# EasyEDA Pro project 26年中国机器人大赛自动分拣机器人主控板_2026-08-09.epro

# Schematic Schematic1
Board Name: Board1; Create Date: 2026-07-24; Page Name: P1; Project Name: 26年中国机器人大赛自动分拣机器人主控板; Schematic Name: Schematic1; Update Date: 2026-07-24; Company: 嘉立创EDA; Page Size: A4; Version: V1.0
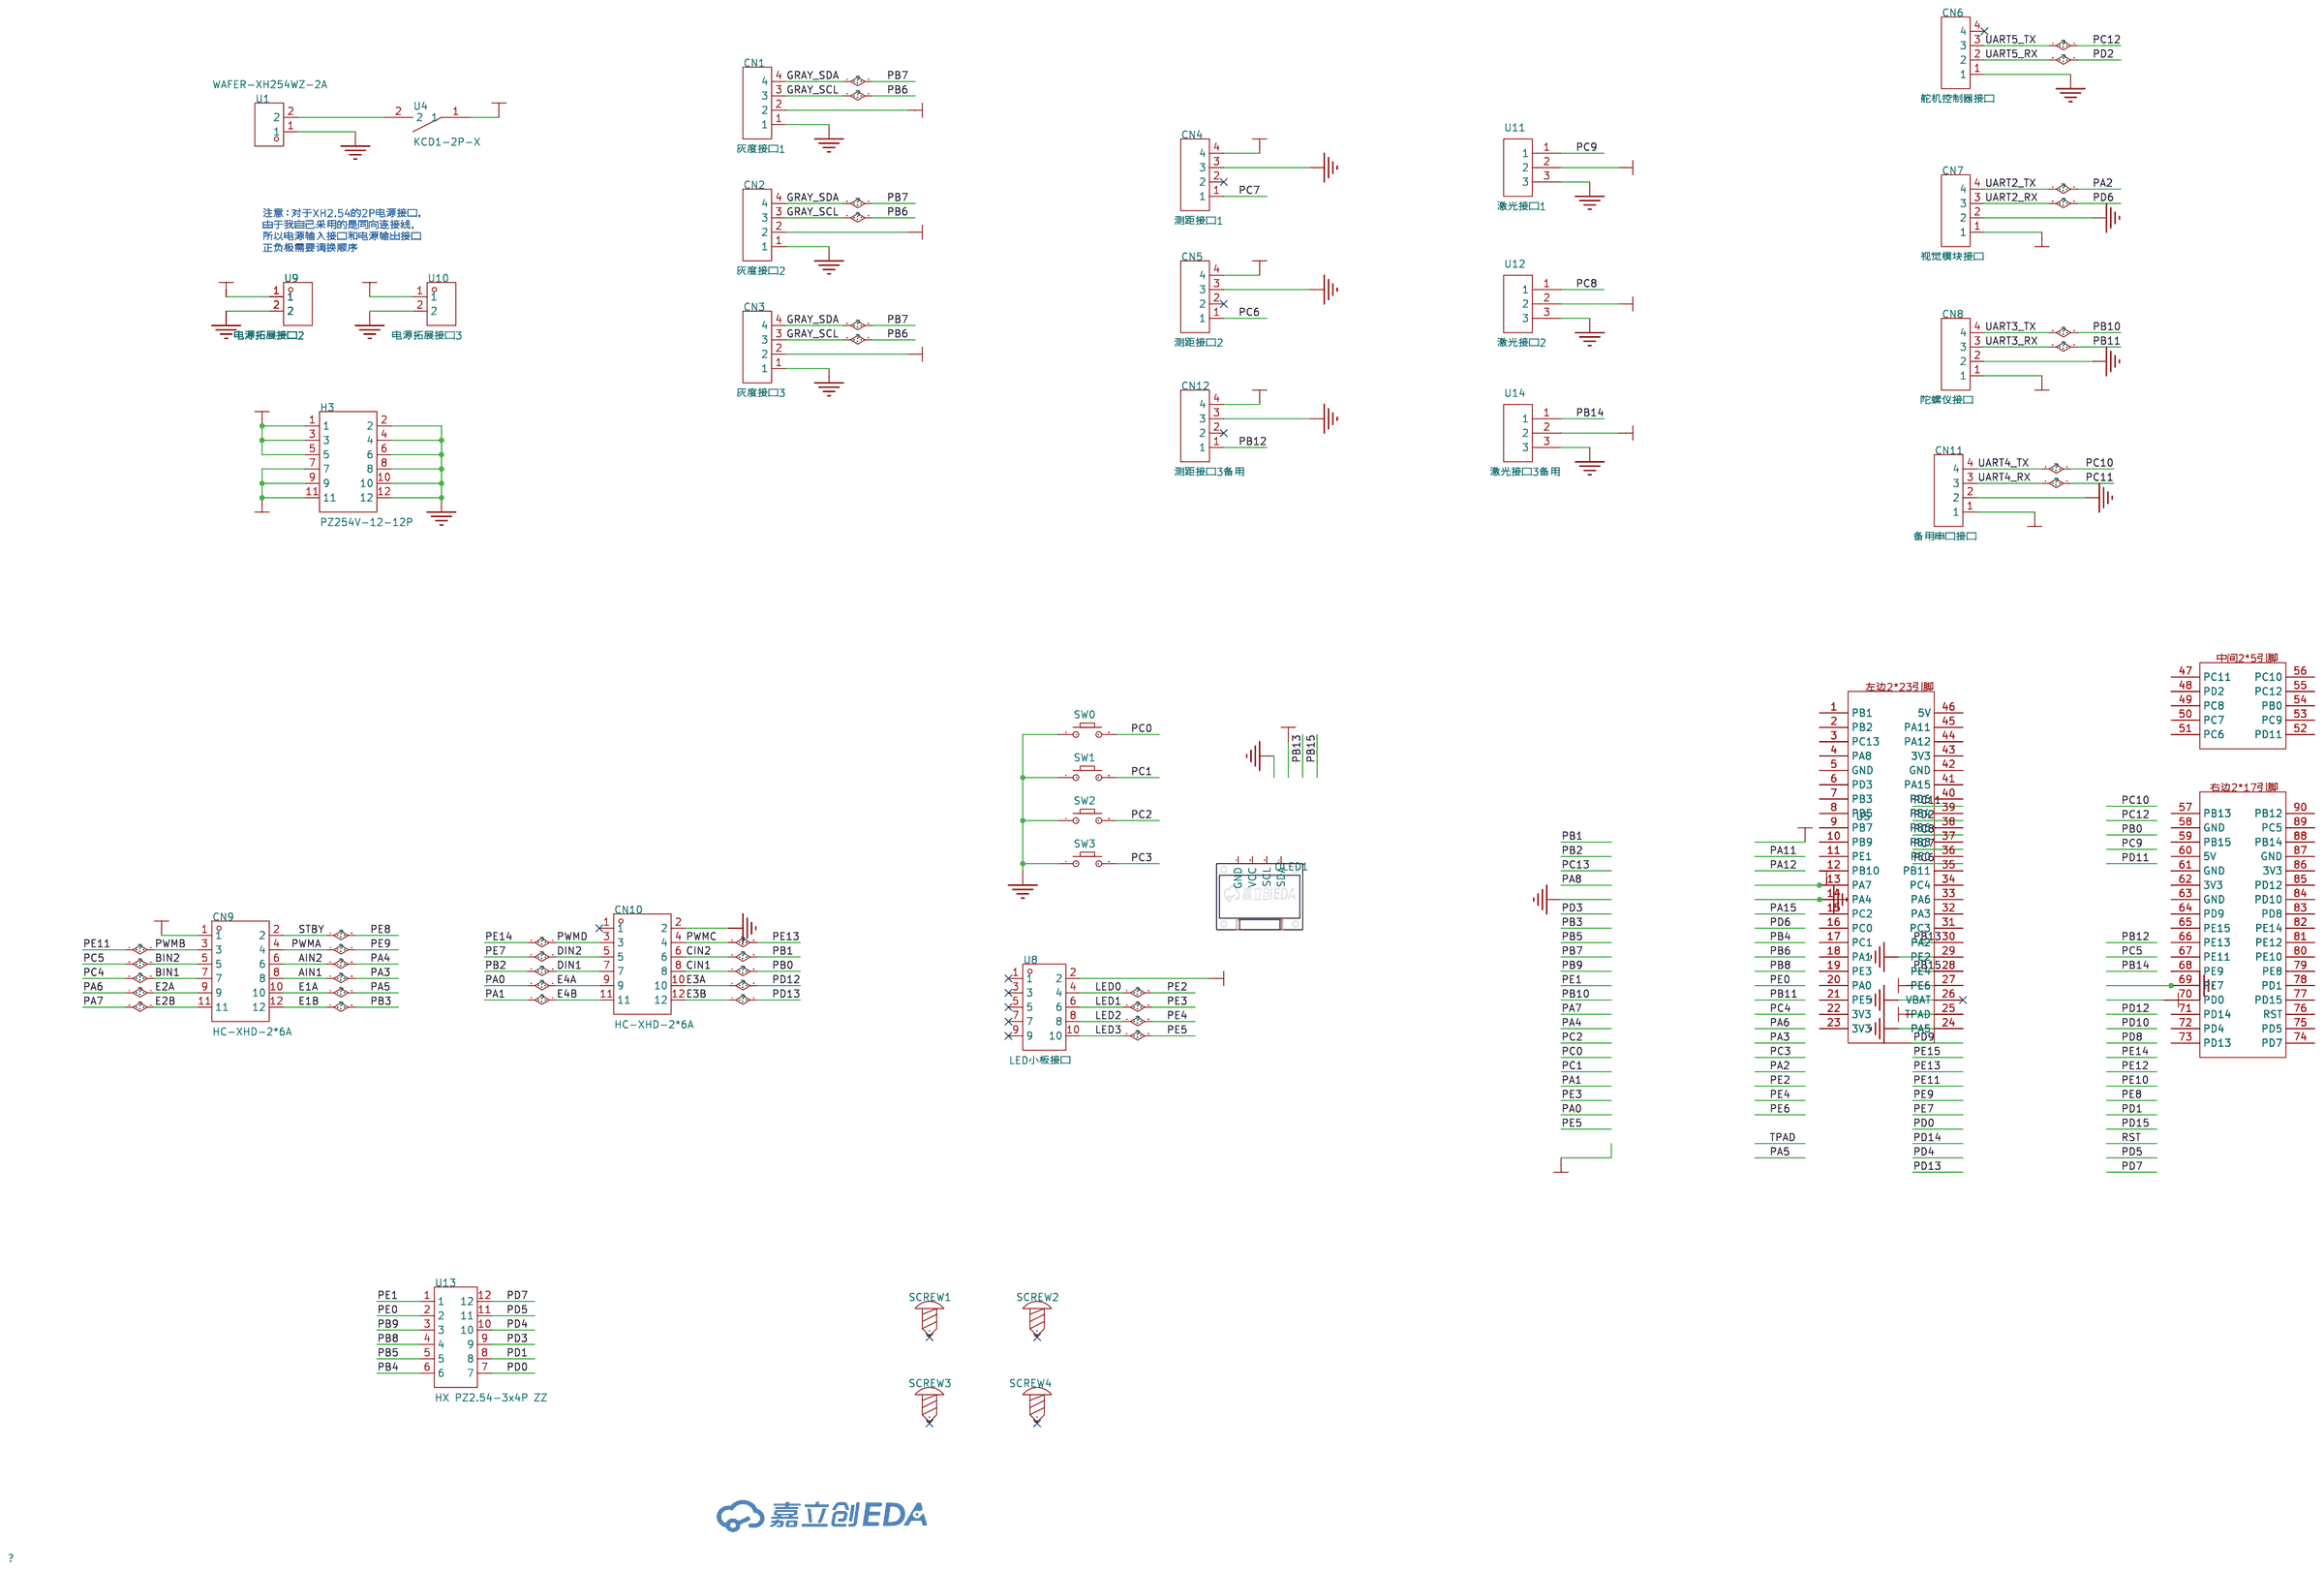
[diagram p0: schematic sheet]

## Parts
CN1  灰度接口1  [CONN-TH_4P-P2.50-XH2.54-4P]
CN2  灰度接口2  [CONN-TH_4P-P2.50-XH2.54-4P]
CN3  灰度接口3  [CONN-TH_4P-P2.50-XH2.54-4P]
CN4  测距接口1  [CONN-TH_4P-P2.50-XH2.54-4P]
CN5  测距接口2  [CONN-TH_4P-P2.50-XH2.54-4P]
CN6  舵机控制器接口  [CONN-TH_4P-P2.50-XH2.54-4P]
CN7  视觉模块接口  [CONN-TH_4P-P2.50-XH2.54-4P]
CN8  陀螺仪接口  [CONN-TH_4P-P2.50-XH2.54-4P]
CN9  HC-XHD-2*6A  [CONN-TH_12P-P2.50_HCTL_HC-XHD-2X6A]
CN10  HC-XHD-2*6A  [CONN-TH_12P-P2.50_HCTL_HC-XHD-2X6A]
CN11  备用串口接口  [CONN-TH_4P-P2.50-XH2.54-4P]
CN12  测距接口3备用  [CONN-TH_4P-P2.50-XH2.54-4P]
H3  PZ254V-12-12P  [HDR-TH_12P-P2.54-V-M-R2-C6-S2.54]
OLED1  -  [0.96OLED_4P]
SCREW1  -  [M3螺丝]
SCREW2  -  [M3螺丝]
SCREW3  -  [M3螺丝]
SCREW4  -  [M3螺丝]
SW0  -  [Key_TH_3.5x6x4.3]
SW1  -  [Key_TH_3.5x6x4.3]
SW2  -  [Key_TH_3.5x6x4.3]
SW3  -  [Key_TH_3.5x6x4.3]
U1  WAFER-XH254WZ-2A  [CONN-TH_2P-P2.50_WAFER-XH254WZ-2A]
U4  KCD1-2P-X  [SW-TH_KCD1-101]
U5  -  [STM32F407勇气号]
U8  LED小板接口  [HDR-TH_10P-P2.54-V-F-R2-C5-S2.54]
U9  电源拓展接口2  [CONN-TH_2P-P2.50_WAFER-XH254WZ-2A]
U10  电源拓展接口3  [CONN-TH_2P-P2.50_WAFER-XH254WZ-2A]
U11  激光接口1  [CONN-TH_3P-P2.50_A2501WV2-3P]
U12  激光接口2  [CONN-TH_3P-P2.50_A2501WV2-3P]
U13  HX PZ2.54-3x4P ZZ  [HDR-TH_12P-P2.54-V-M-R3-C4-S2.54]
U14  激光接口3备用  [CONN-TH_3P-P2.50_A2501WV2-3P]

## Library data of the parts
CN1-CN8 CN11 CN12 = HX-XH2.54-4PZZ: 插针结构:1x4P;间距:2.54mm;安装方式:直插;参考系列:XH;总PIN数:4P;排数:1;每排PIN数:4;行距:-;额定电流:3A;触头材质:黄铜;触头镀层:锡;工作温度:-25℃~+85℃;; LCSC Part Name: 1x4P 间距:2.54mm 直插 系列:XH; Supplier Part: C42391662; Manufacturer: hanxia(韩下); Supplier Footprint: 插件,P=2.5mm; JLCPCB Part Class: 扩展库; Datasheet: https://item.szlcsc.com/datasheet/HX-XH2.54-4PZZ/44326934.html; Supplier: LCSC; Pins Structure: 1x4P; Pitch: 2.54mm; Mounting Type: 直插; Reference Series: XH; Number of Pins: 4P; Number of Rows: 1; Number of PINs Per Row: 4; Current Rating: 3A; Contact Material: 黄铜; Contact Plating: 锡; Operating Temperature: -25℃~+85℃; Voltage Rating: 250V; Plastic Material: PA66; Flame Retardant Rating: UL94V-0; Color: 白色
CN9 CN10 = HC-XHD-2*6A: 插针结构:2x6P;间距:2.5mm;安装方式:直插;参考系列:DF1B;总PIN数:12P;排数:2;每排PIN数:6;行距:2.5mm;额定电流:3A;触头材质:黄铜;触头镀层:锡;工作温度:-25℃~+85℃;; LCSC Part Name: 2x6P 间距:2.5mm 直插 系列:DF1B; Supplier Part: C2845653; Manufacturer: HCTL(华灿天禄); Supplier Footprint: 插件,P=2.5mm; JLCPCB Part Class: 扩展库; Datasheet: https://item.szlcsc.com/datasheet/HC-XHD-2*6A/3039334.html; Supplier: LCSC; Pins Structure: 2x6P; Pitch: 2.5mm; Mounting Type: 直插; Reference Series: DF1B; Number of Pins: 12P; Number of Rows: 2; Number of PINs Per Row: 6; Row Spacing: 2.5mm; Current Rating: 3A; Contact Material: 黄铜; Contact Plating: 锡; Operating Temperature: -25℃~+85℃; Voltage Rating: 250V; Plastic Material: PA66; Z-Height of the Board: 9.5mm; X-Length of Bottom Edge on Board (Spacing Line): 17.5mm; Y-Width of Bottom Edge on Board: 8.6mm
H3 = PZ254V-12-12P: 插针结构:2x6P;间距:2.54mm;行距:2.54mm;圆针/方针:方针;安装方式:直插;排数:双排;总PIN位数:12P;额定电流:-;额定电压:-;配合针长度:6mm;塑高:2.5mm;端接针长度:3mm;触头材质:黄铜;触头镀层:-;工作温度:-40℃~+105℃;颜色:黑色;; LCSC Part Name: 2x6P 间距:2.54mm 方针 直插; Supplier Part: C492423; Manufacturer: XFCN(兴飞); Supplier Footprint: 插件,P=2.54mm; JLCPCB Part Class: 扩展库; Datasheet: https://item.szlcsc.com/datasheet/PZ254V-12-12P/502979.html; Supplier: LCSC; Pin Structure: 2x6P; Pitch: 2.54mm; Row Spacing: 2.54mm; Circluar Pins/Square Pins: 方针; Mounting Type: 直插; Number of Rows: 双排; Number of Pins: 12P; Length of Mating Pin: 6mm; Insulation Height: 2.5mm; Length of End Connection Pin: 3mm; Contact Material: 黄铜; Operating Temperature: -40℃~+105℃; Color: 黑色
OLED1 = 0.96OLED模块_4P: Supplier Footprint: 插件
SCREW1-SCREW4 = M3螺丝: Supplier Footprint: 插件
SW0-SW3 = Key_TH_3.5x6x4.3: Supplier Footprint: 插件
U1 U9 U10 = WAFER-XH254WZ-2A: 插针结构:1x2P;间距:2.54mm;安装方式:弯插;参考系列:XH;总PIN数:2P;排数:1;每排PIN数:2;额定电流:3A;触头材质:黄铜;工作温度:-25℃~+85℃;; LCSC Part Name: 1x2P 间距:2.54mm 弯插 系列:XH; Supplier Part: C7432691; Manufacturer: HANBO(汉博); Supplier Footprint: 插件,P=2.5mm; JLCPCB Part Class: 扩展库; Datasheet: https://item.szlcsc.com/datasheet/WAFER-XH254WZ-2A/8437688.html; Supplier: LCSC; Pins Structure: 1x2P; Pitch: 2.54mm; Mounting Type: 弯插; Reference Series: XH; Number of Pins: 2P; Number of Rows: 1; Number of PINs Per Row: 2; Current Rating: 3A; Contact Material: 黄铜; Operating Temperature: -25℃~+85℃; Voltage Rating: 250V; Plastic Material: PA66; Flame Retardant Rating: UL94V-0
U4 = 船型开关KCD1-2P-X: 带灯:无;引脚样式:焊片;额定电流:6A;额定电压(AC):250V;额定电压(DC):-;电路结构:单刀单掷;机械寿命:1万次;; Manufacturer: SHOU HAN(首韩); Supplier: LCSC; Supplier Part: C5884416; LCSC Part Name: 15*21mm 两脚两档跷板开关 斜面 黑; Supplier Footprint: 插件; JLCPCB Part Class: 扩展库; Datasheet: https://atta.szlcsc.com/upload/public/pdf/source/20230506/16C42A317FEEB785E209504D8AD10702.pdf; Switch Length: 21mm; Switch Width: 15mm; Switch Height: 21mm; Actuator Type: 凹面弯曲; With Lamp: 无; Pin Style: 焊片; Actuator Color: 黑色; Contact Current: 6A; Voltage Rating (AC): 250V; Circuit: 单刀单掷; Mechanical Life: 1万次; Operating Temperature: 0℃~+125℃; Actuator Identifier: - O
U5 = STM32F407勇气号
U8 = PM254-2-05-Z-8.5: 插孔结构:2x5P;间距:2.54mm;行距:2.54mm;圆孔/方孔:方孔;安装方式:直插;排数:双排;总孔位数:10P;额定电流:3A;额定电压:-;插孔方向:顶部;塑高:8.5mm;触头材质:铜合金;工作温度:-40℃~+105℃;; LCSC Part Name: 2x5P 间距:2.54mm 直插; Supplier Part: C2897406; Manufacturer: HCTL(华灿天禄); Supplier Footprint: 插件,P=2.54mm; JLCPCB Part Class: 扩展库; Datasheet: https://item.szlcsc.com/datasheet/PM254-2-05-Z-8.5/3142411.html; Supplier: LCSC; Holes Structure: 2x5P; Pitch: 2.54mm; Row Spacing: 2.54mm; Circular Hole / Square Hole: 方孔; Mounting Type: 直插; Number of Rows: 双排; Number of Positions: 10P; Current Rating: 3A; Holes Direction: 顶部; Insulation Height: 8.5mm; Contact Material: 铜合金; Operating Temperature: -40℃~+105℃
U11 U12 U14 = B3B-XH-A(LF)(SN): 插针结构:1x3P;间距:2.5mm;安装方式:直插;参考系列:XH;总PIN数:3P;排数:1;每排PIN数:3;行距:-;额定电流:3A;触头材质:黄铜;触头镀层:锡;工作温度:-25℃~+85℃;; LCSC Part Name: 1x3P 间距:2.5mm 直插 系列:XH; Supplier Part: C144394; Manufacturer: JST; Supplier Footprint: 插件,P=2.5mm; JLCPCB Part Class: 扩展库; Datasheet: https://item.szlcsc.com/datasheet/B3B-XH-A(LF)(SN)/155726.html; Supplier: LCSC; Pins Structure: 1x3P; Pitch: 2.5mm; Mounting Type: 直插; Reference Series: XH; Number of Pins: 3P; Number of Rows: 1; Number of PINs Per Row: 3; Current Rating: 3A; Contact Material: 黄铜; Contact Plating: 锡; Operating Temperature: -25℃~+85℃; Voltage Rating: 250V; Plastic Material: PA66; Flame Retardant Rating: UL94V-0; Supplementary Features: 打K脚; Color: 白色; Z-Height of the Board: 7mm; X-Length of Bottom Edge on Board (Spacing Line): 9.9mm; Y-Width of Bottom Edge on Board: 5.75mm
U13 = HX PZ2.54-3x4P ZZ: 插针结构:3x4P;间距:2.54mm;行距:2.54mm;圆针/方针:方针;安装方式:直插;排数:三排;总PIN位数:12P;额定电流:3A;额定电压:1kV;配合针长度:6mm;塑高:2.5mm;端接针长度:3mm;触头材质:黄铜;触头镀层:金;工作温度:-40℃~+105℃;颜色:黑色;; LCSC Part Name: 3x4P 间距:2.54mm 方针 直插; Supplier Part: C32713291; Manufacturer: hanxia(韩下); Supplier Footprint: 插件,P=2.54mm; JLCPCB Part Class: 扩展库; Datasheet: https://item.szlcsc.com/datasheet/HX%2520PZ2.54-3x4P%2520ZZ/34444571.html; Supplier: LCSC; Pin Structure: 3x4P; Pitch: 2.54mm; Row Spacing: 2.54mm; Circluar Pins/Square Pins: 方针; Mounting Type: 直插; Number of Rows: 三排; Number of Pins: 12P; Current Rating: 3A; Voltage Rating (Max): 1kV; Length of Mating Pin: 6mm; Insulation Height: 2.5mm; Length of End Connection Pin: 3mm; Contact Material: 黄铜; Contact Plating: 金; Operating Temperature: -40℃~+105℃; Color: 黑色

## Nets
3V3: CN9.1 H3.7 H3.9 H3.11 U5.13(PA7) U5.25(TPAD) U8.2
5V: CN1.2 CN2.2 CN3.2 CN4.4 CN5.4 CN7.1 CN8.1 CN11.1 CN12.4 H3.1 H3.3 H3.5 U4.1 U5.27(PE6) U9.1 U10.1 U11.2 U12.2 U14.2
GND: CN1.1 CN2.1 CN3.1 CN4.3 CN5.3 CN6.1 CN7.2 CN8.2 CN10.2 CN11.2 CN12.3 H3.2 H3.4 H3.6 H3.8 H3.10 H3.12 SW0.A SW1.A SW2.A SW3.A U1.1 U5.14(PA4) U5.24(PA5) U5.26(VBAT) U5.29(PE2) U5.69(PE7) U9.2 U10.2 U11.3 U12.3 U14.3
AIN1: CN9.8
AIN2: CN9.6
BIN1: CN9.7
BIN2: CN9.5
CIN1: CN10.8
CIN2: CN10.6
DIN1: CN10.7
DIN2: CN10.5
E1A: CN9.10
E1B: CN9.12
E2A: CN9.9
E2B: CN9.11
E3A: CN10.10
E3B: CN10.12
E4A: CN10.9
E4B: CN10.11
GRAY_SCL: CN1.3 CN2.3 CN3.3
GRAY_SDA: CN1.4 CN2.4 CN3.4
LED0: U8.4
LED1: U8.6
LED2: U8.8
LED3: U8.10
PA2: CN7.4
PB4: U13.6
PB5: U13.5
PB8: U13.4
PB9: U13.3
PB10: CN8.4
PB11: CN8.3
PB12: CN12.1
PB13: U5.30(PA2)
PB14: U14.1
PB15: U5.28(PE4)
PC0: SW0.B
PC1: SW1.B
PC2: SW2.B
PC3: SW3.B
PC6: CN5.1
PC7: CN4.1
PC8: U12.1
PC9: U11.1
PC10: CN11.4
PC11: CN11.3
PC12: CN6.3
PD0: U13.7
PD1: U13.8
PD2: CN6.2
PD3: U13.9
PD4: U13.10
PD5: U13.11
PD6: CN7.3
PD7: U13.12
PE0: U13.2
PE1: U13.1
PE8: CN9.2
PE9: CN9.4
PE11: CN9.3
PE13: CN10.4
PE14: CN10.3
$1N183: U1.2 U4.2

Not connected (* = marked no-connect by the designer): CN4 2*; CN5 2*; CN6 4*; CN10 1*; CN12 2*; OLED1 1(GND) 2(VCC) 3(SCL) 4(SDA); SCREW1 1*; SCREW2 1*; SCREW3 1*; SCREW4 1*; U5 1(PB1) 2(PB2) 3(PC13) 4(PA8) 5(GND) 6(PD3) 7(PB3) 8(PB5) 9(PB7) 10(PB9) 11(PE1) 12(PB10) 15(PC2) 16(PC0) 17(PC1) 18(PA1) 19(PE3) 20(PA0) 21(PE5) 22(3V3) 23(3V3) 31(PC3) 32(PA3) 33(PA6) 34(PC4) 35(PB11) 36(PE0) 37(PB8) 38(PB6) 39(PB4) 40(PD6) 41(PA15) 42(GND) 43(3V3) 44(PA12) 45(PA11) 46(5V) 47(PC11) 48(PD2) 49(PC8) 50(PC7) 51(PC6) 52(PD11) 53(PC9) 54(PB0) 55(PC12) 56(PC10) 57(PB13) 58(GND) 59(PB15) 60(5V) 61(GND) 62(3V3) 63(GND) 64(PD9) 65(PE15) 66(PE13) 67(PE11) 68(PE9) 70(PD0) 71(PD14) 72(PD4) 73(PD13) 74(PD7) 75(PD5) 76(RST) 77(PD15) 78(PD1) 79(PE8) 80(PE10) 81(PE12) 82(PE14) 83(PD8) 84(PD10) 85(PD12) 86(3V3) 87(GND) 88(PB14) 89(PC5) 90(PB12); U8 1* 3* 5* 7* 9*

## Notes on the sheet
- 注意：对于XH2.54的2P电源接口，
  由于我自己采用的是同向连接线，
  所以电源输入接口和电源输出接口
  正负极需要调换顺序

# Board PCB1
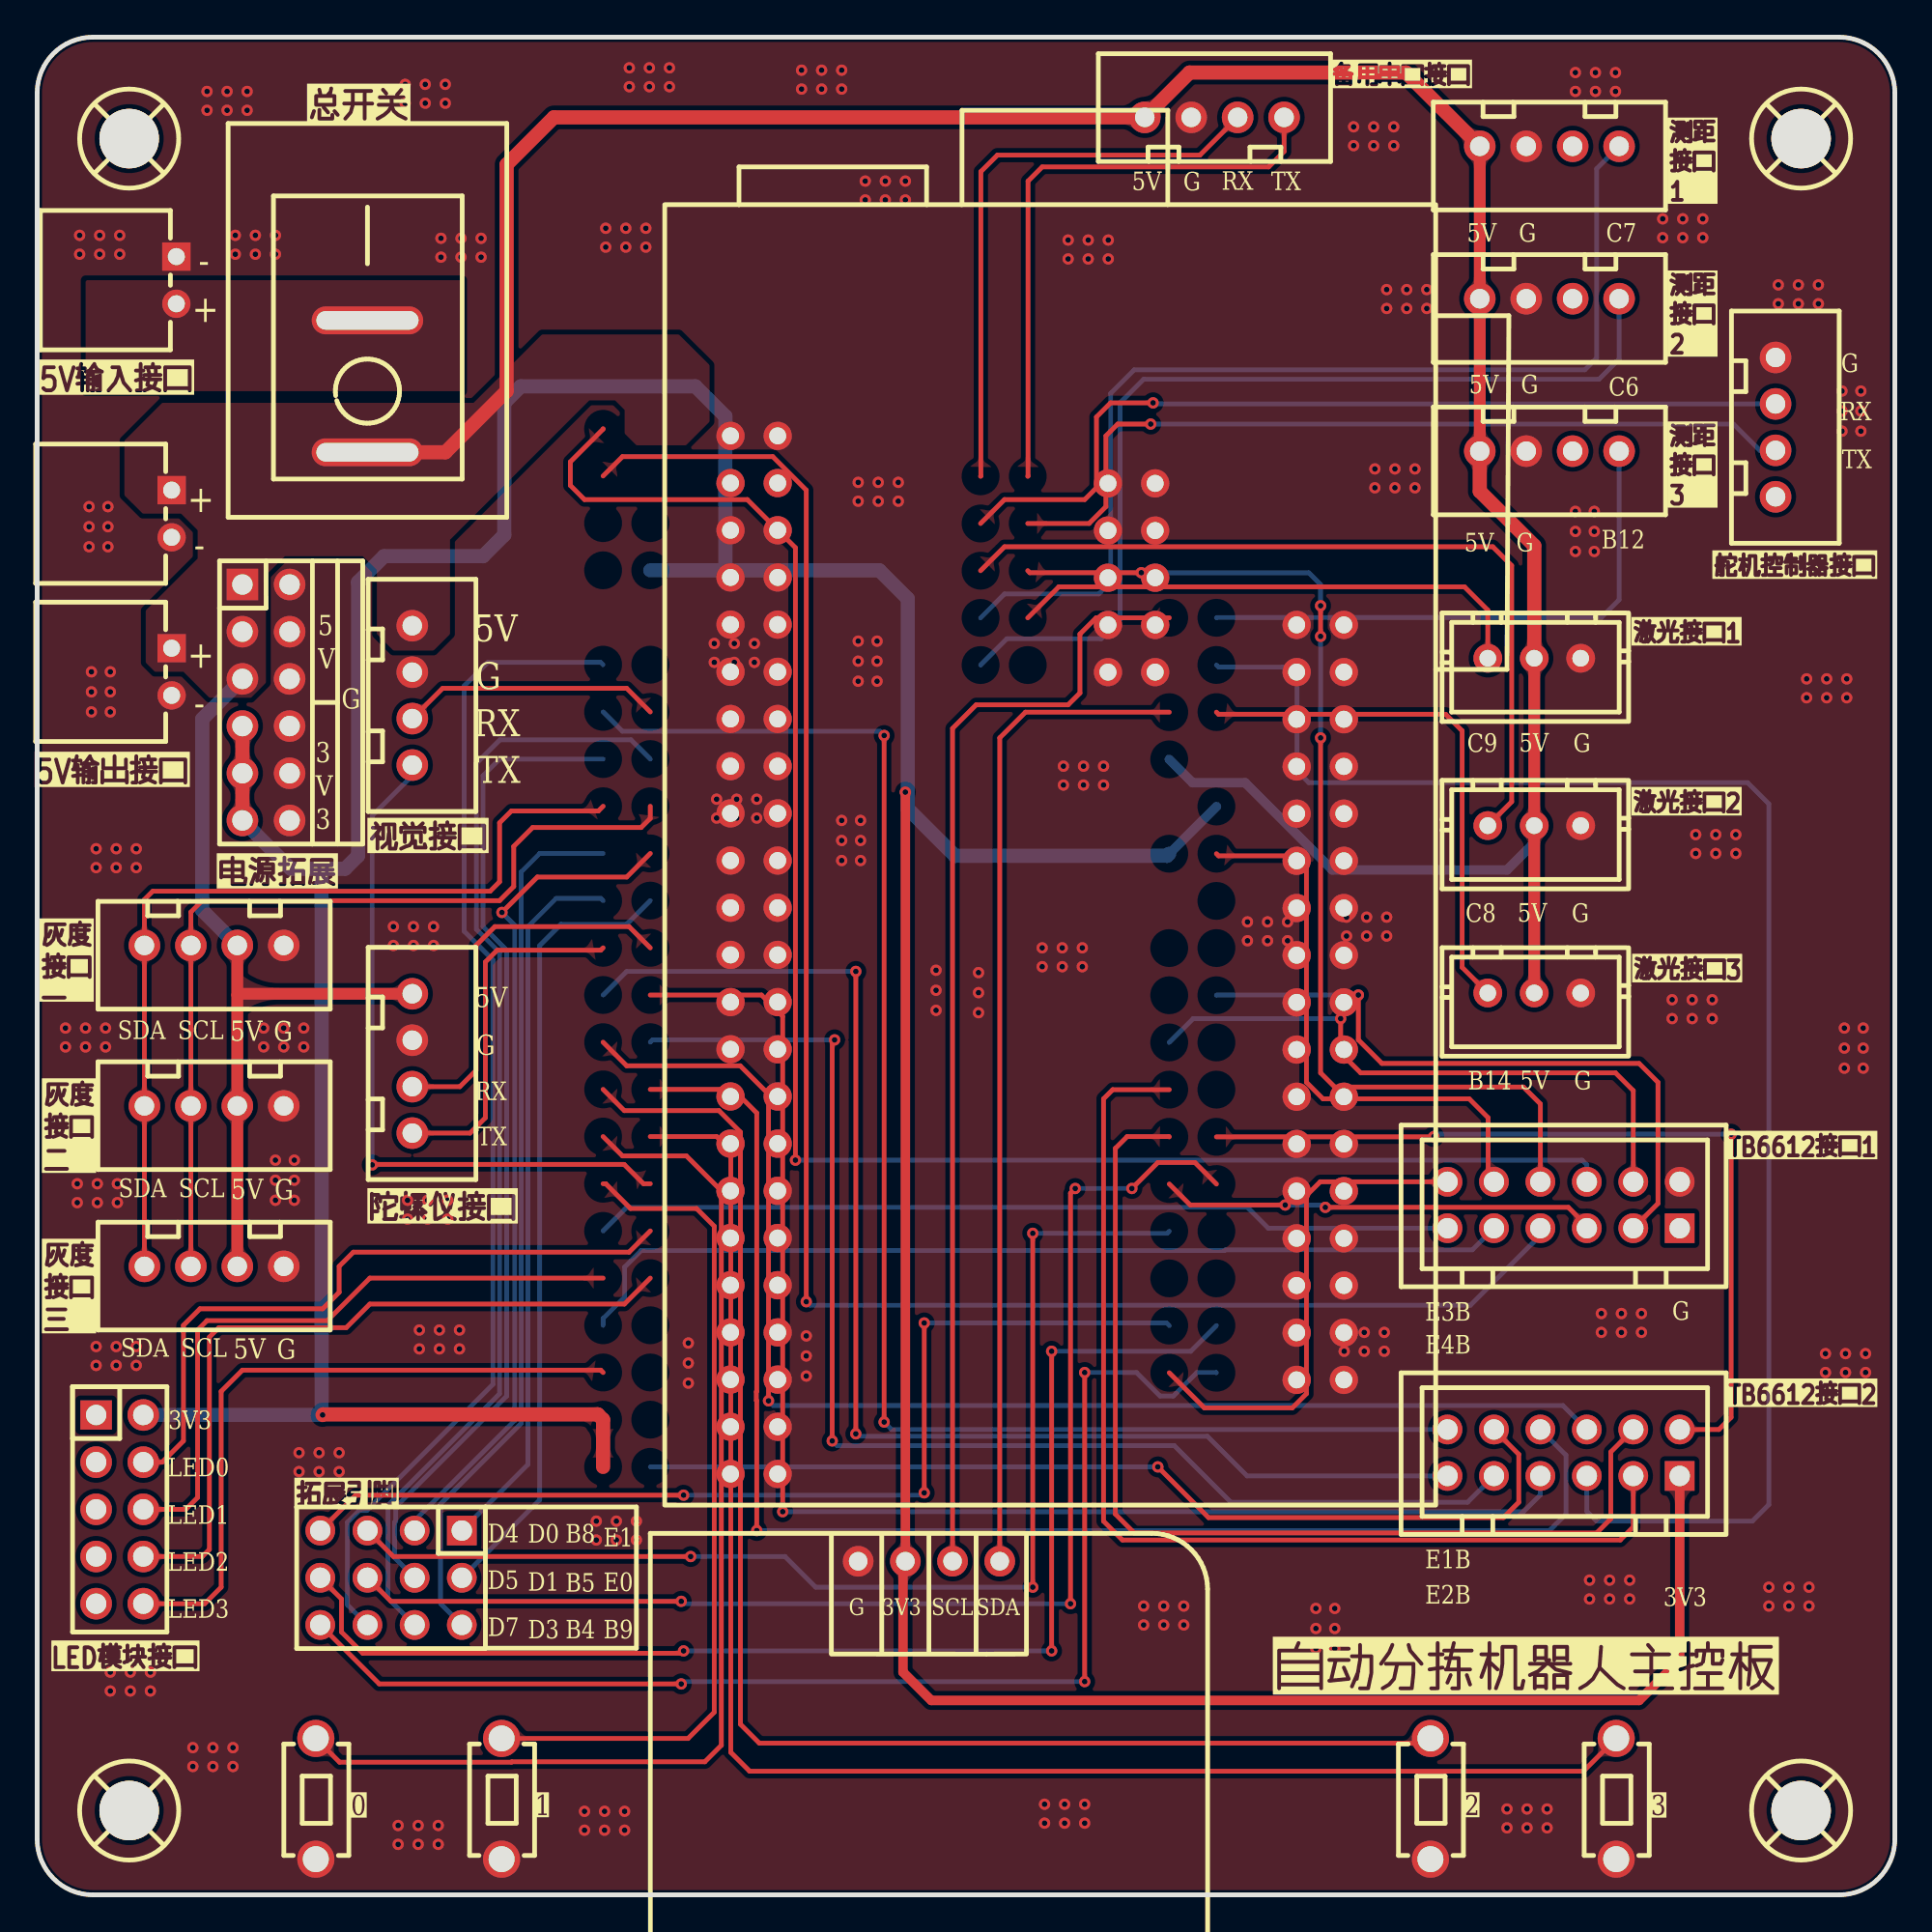
[diagram p1: board, top side]
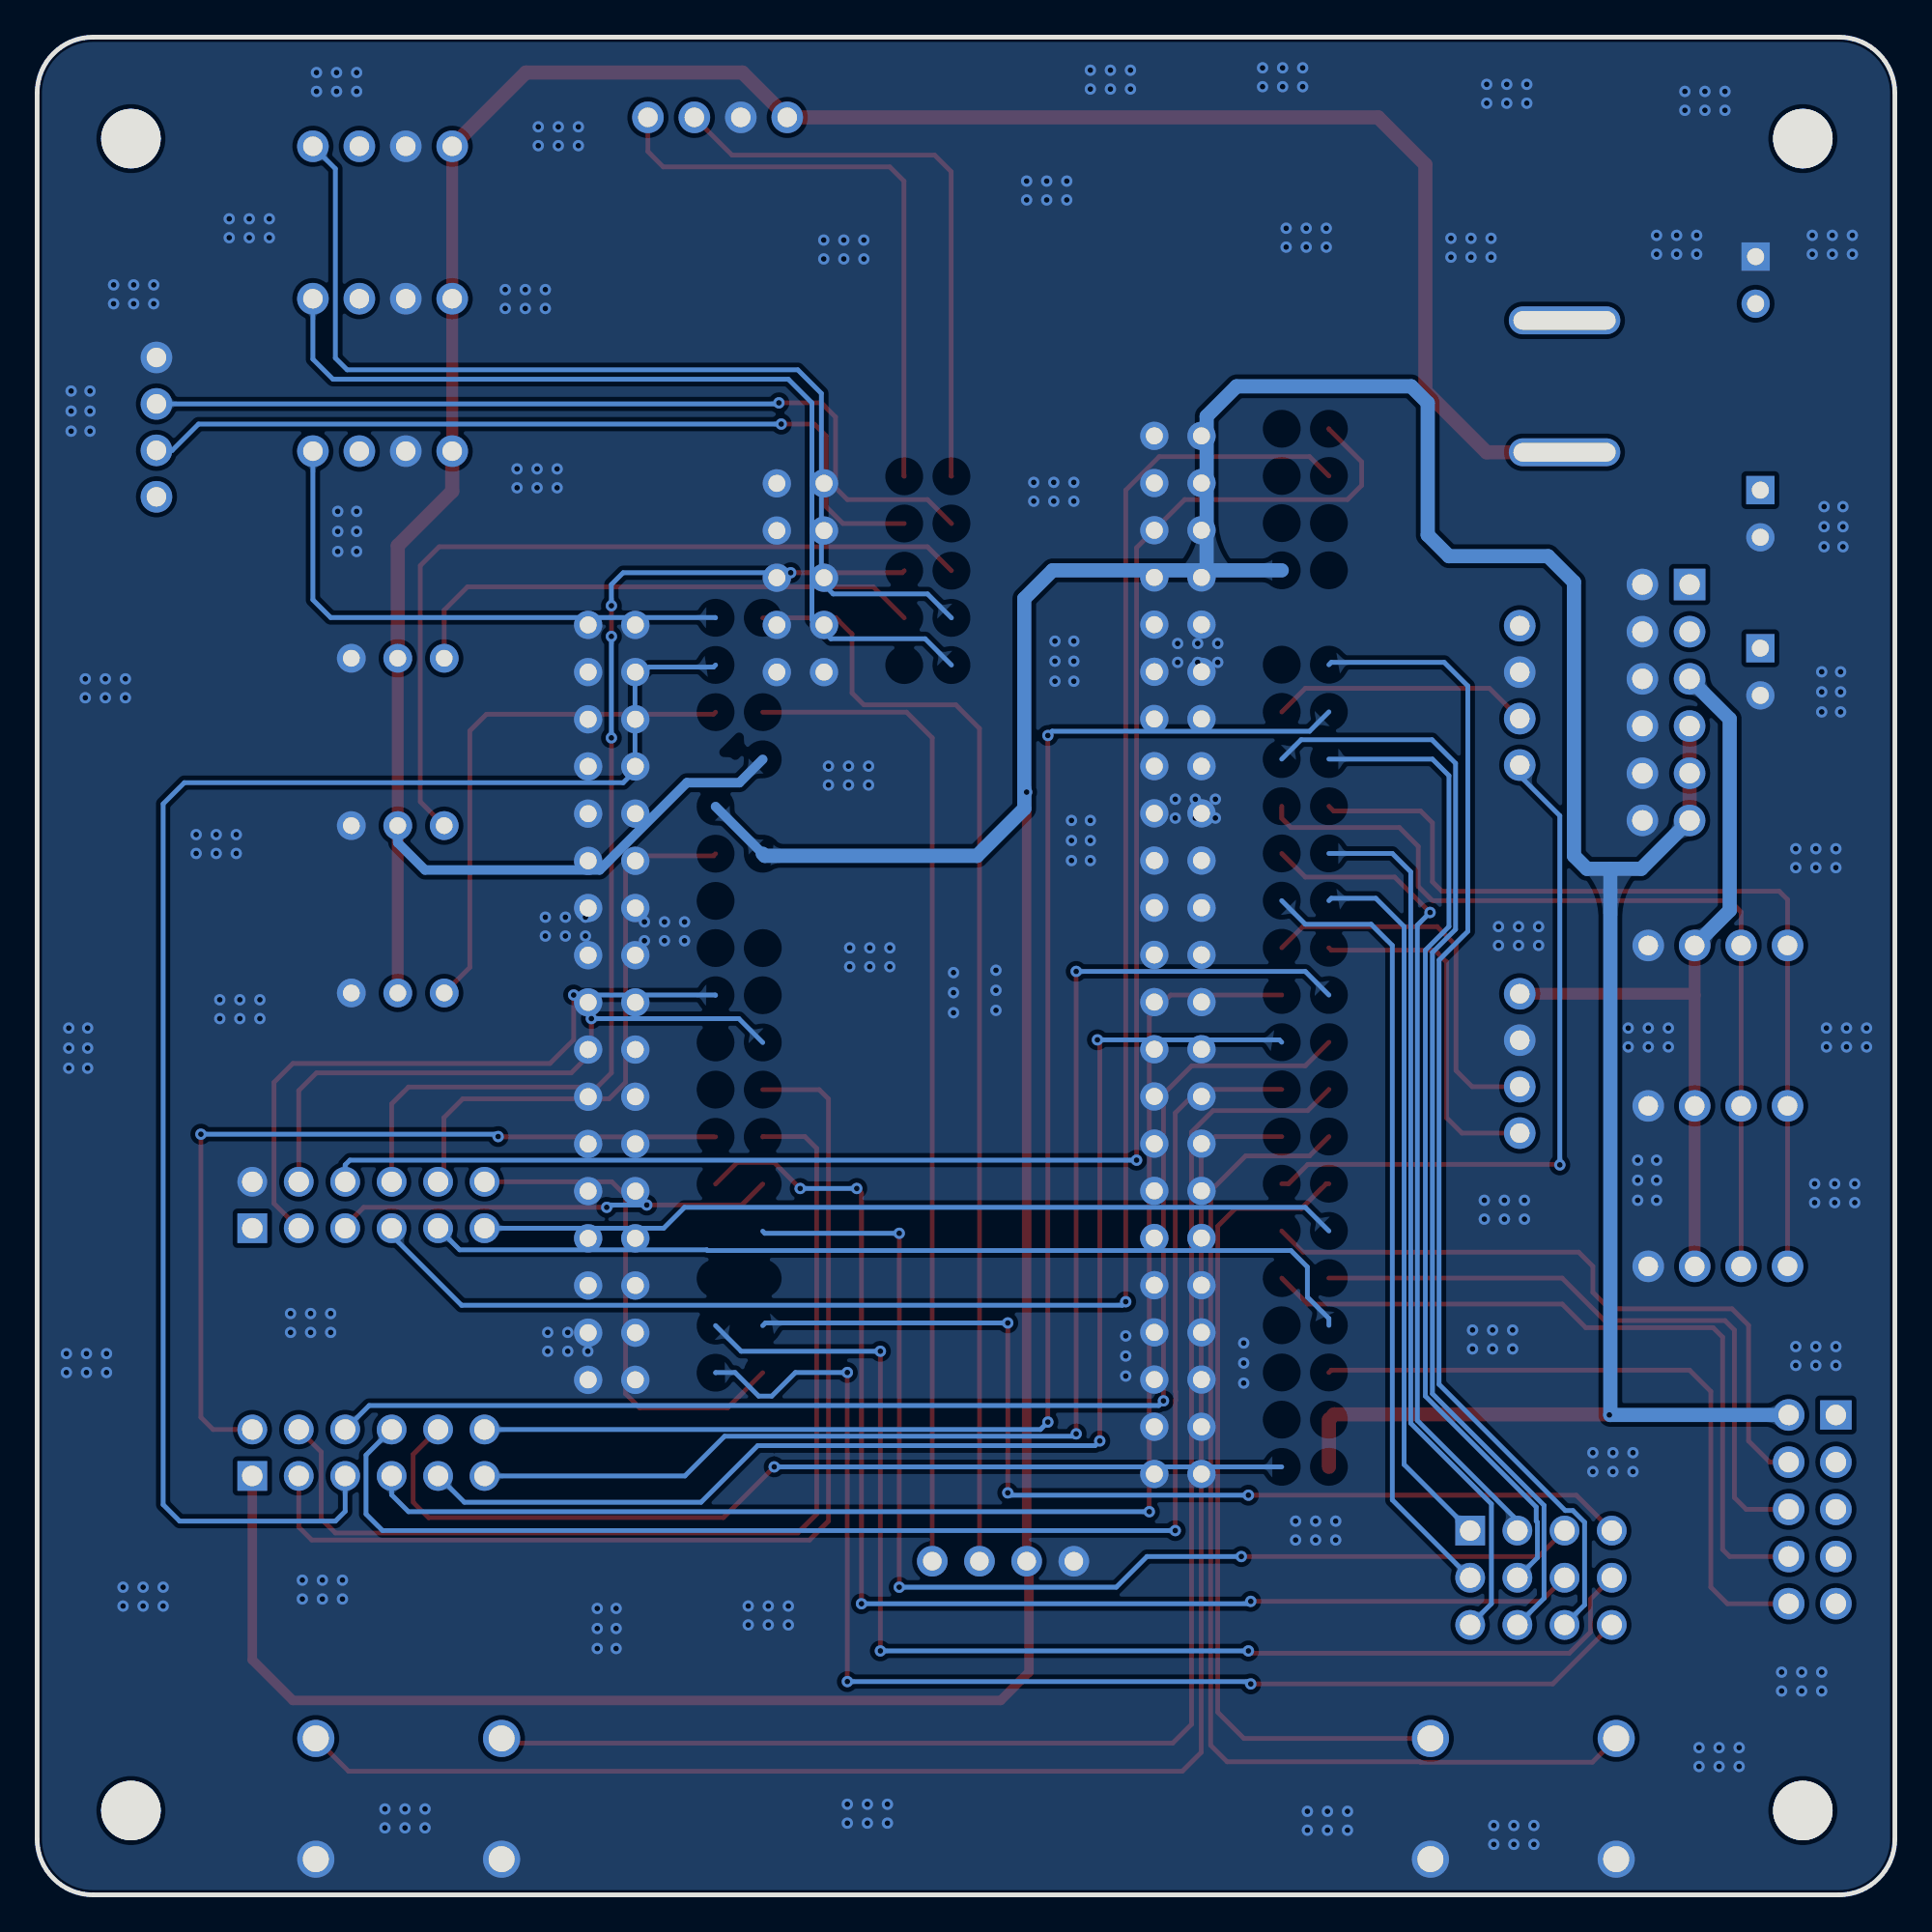
[diagram p2: board, bottom side, seen from below]

Outline 100 x 100 mm; copper layers: Top Layer, Bottom Layer. Coordinates in mm from the lower left corner of the outline.
Outline path: 0,97 0,3 arc(0.88,0.88) 3,0 97,0 arc(99.12,0.88) 100,3 100,97 arc(99.12,99.12) 97,100 3,100 arc(0.88,99.12) 0,97
Stack: Top Layer 0.035mm / Dielectric1 1.51mm FR4 er 4.5 / Bottom Layer 0.035mm

## Design rules (mm)
template: 自定义配置
spacing copperThickness1oz (default): track to track 0.102, other pairs 0.152 to 0.3
spacing copperThickness2oz: track to track 0.203, other pairs 0.152 to 0.3
track width copperThickness1oz (default): min 0.127, default 0.254, max 2.54
track width copperThickness2oz: min 0.203, default 0.254, max 2.54
differential pair differentialPair (default): width min 0.127, default 0.254, max 2.54; gap min 0.152, default 0.152
via viaSize (default): diameter min 0.5, default 0.61, max 10; hole min 0.3, default 0.305, max 6.3

## Placement (name value [footprint] x y rotation side)
CN1  灰度接口1  [CONN-TH_4P-P2.50-XH2.54-4P]  9.53 51.11 0 top
CN2  灰度接口2  [CONN-TH_4P-P2.50-XH2.54-4P]  9.53 42.47 0 top
CN3  灰度接口3  [CONN-TH_4P-P2.50-XH2.54-4P]  9.53 33.83 0 top
CN4  测距接口1  [CONN-TH_4P-P2.50-XH2.54-4P]  81.41 94.12 0 top
CN5  测距接口2  [CONN-TH_4P-P2.50-XH2.54-4P]  81.41 85.92 0 top
CN6  舵机控制器接口  [CONN-TH_4P-P2.50-XH2.54-4P]  93.58 79.01 90 top
CN7  视觉模块接口  [CONN-TH_4P-P2.50-XH2.54-4P]  20.19 64.57 90 top
CN8  陀螺仪接口  [CONN-TH_4P-P2.50-XH2.54-4P]  20.19 44.75 90 top
CN9  HC-XHD-2*6A  [CONN-TH_12P-P2.50_HCTL_HC-XHD-2X6A]  82.17 23.8 0 top
CN10  HC-XHD-2*6A  [CONN-TH_12P-P2.50_HCTL_HC-XHD-2X6A]  82.17 37.14 0 top
CN11  备用串口接口  [CONN-TH_4P-P2.50-XH2.54-4P]  63.37 95.68 180 top
CN12  测距接口3备用  [CONN-TH_4P-P2.50-XH2.54-4P]  81.41 77.72 0 top
H3  PZ254V-12-12P  [HDR-TH_12P-P2.54-V-M-R2-C6-S2.54]  12.32 64.19 270 top
OLED1  -  [0.96OLED_4P]  48.01 17.96 0 top
SCREW1  -  [M3螺丝]  4.95 94.54 0 top
SCREW2  -  [M3螺丝]  94.95 94.54 0 top
SCREW3  -  [M3螺丝]  4.95 4.54 0 top
SCREW4  -  [M3螺丝]  94.95 4.54 0 top
SW0  -  [Key_TH_3.5x6x4.3]  15 5 90 top
SW1  -  [Key_TH_3.5x6x4.3]  25 5 90 top
SW2  -  [Key_TH_3.5x6x4.3]  75 5 90 top
SW3  -  [Key_TH_3.5x6x4.3]  85 5 90 top
U1  WAFER-XH254WZ-2A  [CONN-TH_2P-P2.50_WAFER-XH254WZ-2A]  7.49 86.92 270 top
U4  KCD1-2P-X  [SW-TH_KCD1-101]  17.78 81.2 270 top
U5  -  [STM32F407勇气号]  26.92 91.36 0 top
U8  LED小板接口  [HDR-TH_10P-P2.54-V-F-R2-C5-S2.54]  4.44 20.75 270 top
U9  电源拓展接口2  [CONN-TH_2P-P2.50_WAFER-XH254WZ-2A]  7.24 65.84 270 top
U10  电源拓展接口3  [CONN-TH_2P-P2.50_WAFER-XH254WZ-2A]  7.24 74.35 270 top
U11  激光接口1  [CONN-TH_3P-P2.50_A2501WV2-3P]  80.59 66.57 0 top
U12  激光接口2  [CONN-TH_3P-P2.50_A2501WV2-3P]  80.59 57.56 0 top
U13  HX PZ2.54-3x4P ZZ  [HDR-TH_12P-P2.54-V-M-R3-C4-S2.54]  19.05 17.07 180 top
U14  激光接口3备用  [CONN-TH_3P-P2.50_A2501WV2-3P]  80.59 48.55 0 top

## Footprints (pads in the part's own frame, mm; a bottom-side part is the same pattern mirrored in y, then rotated)
0.96OLED_4P
  round 1.65 hole 1: 1(-3.81,-0.002) 2(-1.27,0.002) 3(1.27,0.002) 4(3.81,0.002)
CONN-TH_2P-P2.50_WAFER-XH254WZ-2A
  rect 1.524x1.524 hole 0.914: 1(-1.27,0)
  round 1.524 hole 0.914: 2(1.27,0)
CONN-TH_3P-P2.50_A2501WV2-3P
  round 1.55 hole 0.9: 1(-2.5,0) 2(0,0) 3(2.5,0)
CONN-TH_4P-P2.50-XH2.54-4P
  round 1.7 hole 1.05: 1(3.75,0) 2(1.25,0) 3(-1.25,0) 4(-3.75,0)
CONN-TH_12P-P2.50_HCTL_HC-XHD-2X6A
  rect 1.6x1.6 hole 1.1: 1(6.25,-1.25)
  round 1.6 hole 1.1: 2(6.25,1.25) 3(3.75,-1.25) 4(3.75,1.25) 5(1.25,-1.25) 6(1.25,1.25) 7(-1.25,-1.25) 8(-1.25,1.25) 9(-3.75,-1.25) 10(-3.75,1.25) 11(-6.25,-1.25) 12(-6.25,1.25)
HDR-TH_10P-P2.54-V-F-R2-C5-S2.54
  rect 1.575x1.7 hole 1.1: 1(-5.08,-1.27)
  round 1.7 hole 1.1: 2(-5.08,1.27) 3(-2.54,-1.27) 4(-2.54,1.27) 5(0,-1.27) 6(0,1.27) 7(2.54,-1.27) 8(2.54,1.27) 9(5.08,-1.27) 10(5.08,1.27)
HDR-TH_12P-P2.54-V-M-R2-C6-S2.54
  rect 1.7x1.7 hole 1.1: 1(-6.35,-1.27)
  round 1.7 hole 1.1: 2(-6.35,1.27) 3(-3.81,-1.27) 4(-3.81,1.27) 5(-1.27,-1.27) 6(-1.27,1.27) 7(1.27,-1.27) 8(1.27,1.27) 9(3.81,-1.27) 10(3.81,1.27) 11(6.35,-1.27) 12(6.35,1.27)
HDR-TH_12P-P2.54-V-M-R3-C4-S2.54
  rect 1.6x1.6 hole 1.1: 1(-3.81,-2.54)
  round 1.6 hole 1.1: 2(-3.81,0) 3(-3.81,2.54) 4(-1.27,-2.54) 5(-1.27,0) 6(-1.27,2.54) 7(1.27,-2.54) 8(1.27,0) 9(1.27,2.54) 10(3.81,-2.54) 11(3.81,0) 12(3.81,2.54)
Key_TH_3.5x6x4.3
  round 1.999 hole 1.399: A(-3.084,0) B(3.416,0)
M3螺丝
  round 3.2 hole 3.2: 1(0,0)
STM32F407勇气号
  round 1.524 hole 0.914: 1(10.399,-12.827) 2(10.399,-15.367) 3(10.399,-17.907) 4(10.399,-20.447) 5(10.399,-22.987) 6(10.399,-25.527) 7(10.399,-28.067) 8(10.399,-30.607) 9(10.399,-33.147) 10(10.399,-35.687) 11(10.399,-38.227) 12(10.399,-40.767) 13(10.399,-43.307) 14(10.399,-45.847) 15(10.399,-48.387) 16(10.399,-50.927) 17(10.399,-53.467) 18(10.399,-56.007) 19(10.399,-58.547) 20(10.399,-61.087) 21(10.399,-63.627) 22(10.399,-66.167) 23(10.399,-68.707) 24(12.939,-68.707) 25(12.939,-66.167) 26(12.939,-63.627) 27(12.939,-61.087) 28(12.939,-58.547) 29(12.939,-56.007) 30(12.939,-53.467) 31(12.939,-50.927) 32(12.939,-48.387) 33(12.939,-45.847) 34(12.939,-43.307) 35(12.939,-40.767) 36(12.939,-38.227) 37(12.939,-35.687) 38(12.939,-33.147) 39(12.939,-30.607) 40(12.939,-28.067) 41(12.939,-25.527) 42(12.939,-22.987) 43(12.939,-20.447) 44(12.939,-17.907) 45(12.939,-15.367) 46(12.939,-12.827) 47(30.718,-15.384) 48(30.718,-17.924) 49(30.718,-20.464) 50(30.718,-23.004) 51(30.718,-25.544) 52(33.258,-25.544) 53(33.258,-23.004) 54(33.258,-20.464) 55(33.258,-17.924) 56(33.258,-15.384) 57(40.876,-23.002) 58(40.876,-25.542) 59(40.876,-28.082) 60(40.876,-30.622) 61(40.876,-33.162) 62(40.876,-35.702) 63(40.876,-38.242) 64(40.876,-40.782) 65(40.876,-43.322) 66(40.876,-45.862) 67(40.876,-48.402) 68(40.876,-50.942) 69(40.876,-53.482) 70(40.876,-56.022) 71(40.876,-58.562) 72(40.876,-61.102) 73(40.876,-63.642) 74(43.416,-63.642) 75(43.416,-61.102) 76(43.416,-58.562) 77(43.416,-56.022) 78(43.416,-53.482) 79(43.416,-50.942) 80(43.416,-48.402) 81(43.416,-45.862) 82(43.416,-43.322) 83(43.416,-40.782) 84(43.416,-38.242) 85(43.416,-35.702) 86(43.416,-33.162) 87(43.416,-30.622) 88(43.416,-28.082) 89(43.416,-25.542) 90(43.416,-23.002)
SW-TH_KCD1-101
  oval 1.5x6 hole 1x5.5: 1(3.55,0) 2(-3.55,0)

## Nets
3V3: CN9.1 H3.7 H3.9 H3.11 OLED1.2 U5.22 U5.23 U5.43 U5.62 U5.86 U8.2
5V: CN1.2 CN2.2 CN3.2 CN4.4 CN5.4 CN7.1 CN8.1 CN11.1 CN12.4 H3.1 H3.3 H3.5 U4.1 U5.46 U5.60 U9.1 U10.1 U11.2 U12.2 U14.2
GND: CN1.1 CN2.1 CN3.1 CN4.3 CN5.3 CN6.1 CN7.2 CN8.2 CN10.2 CN11.2 CN12.3 H3.2 H3.4 H3.6 H3.8 H3.10 H3.12 OLED1.1 SW0.A SW1.A SW2.A SW3.A U1.1 U5.5 U5.42 U5.58 U5.61 U5.63 U5.87 U9.2 U10.2 U11.3 U12.3 U14.3
AIN1: CN9.8 U5.32
AIN2: CN9.6 U5.14
BIN1: CN9.7 U5.34
BIN2: CN9.5 U5.89
CIN1: CN10.8 U5.54
CIN2: CN10.6 U5.1
DIN1: CN10.7 U5.2
DIN2: CN10.5 U5.69
E1A: CN9.10 U5.24
E1B: CN9.12 U5.7
E2A: CN9.9 U5.33
E2B: CN9.11 U5.13
E3A: CN10.10 U5.85
E3B: CN10.12 U5.73
E4A: CN10.9 U5.20
E4B: CN10.11 U5.18
GRAY_SCL: CN1.3 CN2.3 CN3.3 U5.38
GRAY_SDA: CN1.4 CN2.4 CN3.4 U5.9
LED0: U5.29 U8.4
LED1: U5.19 U8.6
LED2: U5.28 U8.8
LED3: U5.21 U8.10
PA2: CN7.4 U5.30
PA8: U5.4
PA11: U5.45
PA12: U5.44
PA15: U5.41
PB4: U5.39 U13.6
PB5: U5.8 U13.5
PB8: U5.37 U13.4
PB9: U5.10 U13.3
PB10: CN8.4 U5.12
PB11: CN8.3 U5.35
PB12: CN12.1 U5.90
PB13: OLED1.3 U5.57
PB14: U5.88 U14.1
PB15: OLED1.4 U5.59
PC0: SW0.B U5.16
PC1: SW1.B U5.17
PC2: SW2.B U5.15
PC3: SW3.B U5.31
PC6: CN5.1 U5.51
PC7: CN4.1 U5.50
PC8: U5.49 U12.1
PC9: U5.53 U11.1
PC10: CN11.4 U5.56
PC11: CN11.3 U5.47
PC12: CN6.3 U5.55
PC13: U5.3
PD0: U5.70 U13.7
PD1: U5.78 U13.8
PD2: CN6.2 U5.48
PD3: U5.6 U13.9
PD4: U5.72 U13.10
PD5: U5.75 U13.11
PD6: CN7.3 U5.40
PD7: U5.74 U13.12
PD8: U5.83
PD9: U5.64
PD10: U5.84
PD11: U5.52
PD14: U5.71
PD15: U5.77
PE0: U5.36 U13.2
PE1: U5.11 U13.1
PE6: U5.27
PE8: CN9.2 U5.79
PE9: CN9.4 U5.68
PE10: U5.80
PE11: CN9.3 U5.67
PE12: U5.81
PE13: CN10.4 U5.66
PE14: CN10.3 U5.82
PE15: U5.65
RST: U5.76
TPAD: U5.25
$1N183: U1.2 U4.2

Pads without a net: CN4 2; CN5 2; CN6 4; CN10 1; CN12 2; SCREW1 1; SCREW2 1; SCREW3 1; SCREW4 1; U5 26; U8 1 3 5 7 9

## Via types
v1: diameter 0.61, hole 0.305, Top Layer to Bottom Layer, 398 vias

## Routing (per net, layer and track width the routed paths; a pad name or vN(x,y) marks a point on that pad's centre or on a via; arc(x,y) is an arc through that point)
3V3: length 266.7
  Top Layer w0.508: v1(46.74,59.36) OLED1.2 46.61,17.83 46.61,11.99 48.13,10.47 86.23,10.47 88.42,12.65 CN9.1
  Top Layer w0.762: v1(15.37,25.83) 15.4,25.86 30.18,25.86 30.47,25.58 30.47,23.04 ; H3.7 H3.9 H3.11
  Bottom Layer w0.508: 63.48,58.58 60.94,56.04
  Bottom Layer w0.762: 33,71.3 37.05,71.3 ; 37.05,71.3 45.34,71.3 46.86,69.77 46.86,58.47 49.4,55.93 60.83,55.93 60.94,56.04 ; 37.05,71.3 37.05,79.59 35.43,81.2 26.03,81.2 25.15,80.31 25.15,73.2 24,72.06 18.67,72.06 17.27,70.66 17.27,55.93 16.57,55.23 15.32,55.23 ; 15.32,55.23 13.65,55.23 H3.11 ; 15.32,55.23 15.32,25.83 5.72,25.83
5V: length 190.3
  Top Layer w0.635: CN12.4 CN5.4 CN4.4 ; 10.78,48.43 10.85,48.5 CN8.1 ; 10.78,48.43 CN1.2 ; 10.78,48.43 CN2.2 CN3.2 ; U11.2 U12.2 U14.2
  Top Layer w0.762: CN12.4 77.66,75.56 80.59,72.62 U11.2 ; U4.1 21.98,77.65 25.27,80.95 25.27,93.14 27.81,95.68 CN11.1 62.04,98.09 73.69,98.09 CN4.4
  Bottom Layer w0.508: 60.94,61.12 62.2,59.87 65.02,59.87 69.72,55.17 79.12,55.17 80.59,56.64 U12.2
  Bottom Layer w0.762: H3.5 8.89,63.3 8.89,52.99 CN1.2
GND:
  vias: v1(1.52,46.66) v1(1.52,45.64) v1(2.16,38.28) v1(2.16,37.26) v1(2.29,89.33) v1(2.29,88.32) v1(2.6,46.66) v1(2.6,45.64) v1(2.79,74.73) v1(2.79,73.65) v1(2.79,72.57) v1(2.92,65.84) v1(2.92,64.76) v1(2.92,63.68) v1(3.17,56.31) v1(3.17,55.3) v1(3.24,38.28) v1(3.24,37.26) v1(3.17,29.51) v1(3.17,28.5) v1(3.37,89.33) v1(3.37,88.32) v1(3.68,46.66) v1(3.68,45.64) v1(3.81,74.73) v1(3.81,73.65) v1(3.81,72.57) v1(3.94,65.84) v1(3.94,64.76) v1(3.94,63.68) v1(3.94,11.99) v1(3.94,10.97) v1(4.25,56.31) v1(4.25,55.3) v1(4.32,38.28) v1(4.32,37.26) v1(4.25,29.51) v1(4.25,28.5) v1(4.44,89.33) v1(4.44,88.32) v1(5.02,11.99) v1(5.02,10.97) v1(5.33,56.31) v1(5.33,55.3) v1(5.33,29.51) v1(5.33,28.5) v1(6.1,11.99) v1(6.1,10.97) v1(8.38,7.93) v1(8.38,6.91) v1(9.14,97.08) v1(9.14,96.06) v1(9.46,7.93) v1(9.46,6.91) v1(10.22,97.08) v1(10.22,96.06) v1(10.54,7.93) v1(10.54,6.91) v1(10.67,89.33) v1(10.67,88.32) v1(11.3,97.08) v1(11.3,96.06) v1(11.75,89.33) v1(11.75,88.32) v1(12.19,46.66) v1(12.19,45.64) v1(12.83,89.33) v1(12.83,88.32) v1(12.83,39.55) v1(12.83,38.47) v1(12.83,37.39) v1(13.27,46.66) v1(13.27,45.64) v1(13.84,39.55) v1(13.84,38.47) v1(13.84,37.39) v1(14.1,23.8) v1(14.1,22.78) v1(14.35,46.66) v1(14.35,45.64) v1(15.18,23.8) v1(15.18,22.78) v1(16.26,23.8) v1(16.26,22.78) v1(19.18,52.12) v1(19.18,51.11) v1(19.43,3.73) v1(19.43,2.72) v1(19.81,97.46) v1(19.81,96.44) v1(19.94,37.39) v1(19.94,36.37) v1(20.26,52.12) v1(20.26,51.11) v1(20.51,3.73) v1(20.51,2.72) v1(20.57,30.4) v1(20.57,29.39) v1(20.89,97.46) v1(20.89,96.44) v1(21.02,37.39) v1(21.02,36.37) v1(21.34,52.12) v1(21.34,51.11) v1(21.59,3.73) v1(21.59,2.72) v1(21.74,89.17) v1(21.74,88.16) v1(21.65,30.4) v1(21.65,29.39) v1(21.97,97.46) v1(21.97,96.44) v1(22.1,37.39) v1(22.1,36.37) v1(22.73,30.4) v1(22.73,29.39) v1(22.82,89.17) v1(22.82,88.16) v1(23.9,89.17) v1(23.9,88.16) v1(29.46,4.5) v1(29.46,3.48) v1(30.1,20.12) v1(30.1,19.1) v1(30.54,4.5) v1(30.54,3.48) v1(30.61,89.71) v1(30.61,88.7) v1(31.18,20.12) v1(31.18,19.1) v1(31.62,4.5) v1(31.62,3.48) v1(31.69,89.71) v1(31.69,88.7) v1(31.88,98.35) v1(31.88,97.33) v1(32.26,20.12) v1(32.26,19.1) v1(32.77,89.71) v1(32.77,88.7) v1(32.96,98.35) v1(32.96,97.33) v1(34.04,98.35) v1(34.04,97.33) v1(35.05,29.71) v1(35.05,28.63) v1(35.05,27.55) v1(36.45,67.36) v1(36.45,66.34) v1(36.58,58.98) v1(36.58,57.96) v1(37.53,67.36) v1(37.53,66.34) v1(37.66,58.98) v1(37.66,57.96) v1(38.61,67.36) v1(38.61,66.34) v1(38.74,58.98) v1(38.74,57.96) v1(41.15,98.22) v1(41.15,97.21) v1(41.4,30.09) v1(41.4,29.01) v1(41.4,27.93) v1(42.23,98.22) v1(42.23,97.21) v1(43.31,98.22) v1(43.31,97.21) v1(43.31,57.84) v1(43.31,56.76) v1(43.31,55.68) v1(44.2,76.03) v1(44.2,75.02) v1(44.2,67.49) v1(44.2,66.41) v1(44.2,65.33) v1(44.32,57.84) v1(44.32,56.76) v1(44.32,55.68) v1(44.58,92.25) v1(44.58,91.24) v1(45.21,67.49) v1(45.21,66.41) v1(45.21,65.33) v1(45.28,76.03) v1(45.28,75.02) v1(45.66,92.25) v1(45.66,91.24) v1(46.35,76.03) v1(46.35,75.02) v1(46.74,92.25) v1(46.74,91.24) v1(48.39,49.77) v1(48.39,48.69) v1(48.39,47.61) v1(50.67,49.64) v1(50.67,48.56) v1(50.67,47.49) v1(54.1,50.98) v1(54.1,49.96) v1(54.23,4.88) v1(54.23,3.86) v1(55.25,60.76) v1(55.25,59.74) v1(55.18,50.98) v1(55.18,49.96) v1(55.31,4.88) v1(55.31,3.86) v1(55.5,89.08) v1(55.5,88.06) v1(56.32,60.76) v1(56.32,59.74) v1(56.26,50.98) v1(56.26,49.96) v1(56.39,4.88) v1(56.39,3.86) v1(56.58,89.08) v1(56.58,88.06) v1(57.4,60.76) v1(57.4,59.74) v1(57.66,89.08) v1(57.66,88.06) v1(59.56,15.54) v1(59.56,14.53) v1(60.64,15.54) v1(60.64,14.53) v1(61.72,15.54) v1(61.72,14.53) v1(65.15,52.38) v1(65.15,51.36) v1(66.23,52.38) v1(66.23,51.36) v1(67.31,52.38) v1(67.31,51.36) v1(68.83,15.42) v1(68.83,14.34) v1(68.83,13.26) v1(69.85,15.42) v1(69.85,14.34) v1(69.85,13.26) v1(70.36,30.28) v1(70.36,29.26) v1(70.49,52.63) v1(70.49,51.61) v1(70.87,95.17) v1(70.87,94.16) v1(71.44,30.28) v1(71.44,29.26) v1(71.56,52.63) v1(71.56,51.61) v1(71.95,95.17) v1(71.95,94.16) v1(72.01,76.76) v1(72.01,75.74) v1(72.52,30.28) v1(72.52,29.26) v1(72.64,86.41) v1(72.64,85.39) v1(72.64,52.63) v1(72.64,51.61) v1(73.03,95.17) v1(73.03,94.16) v1(73.09,76.76) v1(73.09,75.74) v1(73.72,86.41) v1(73.72,85.39) v1(74.17,76.76) v1(74.17,75.74) v1(74.8,86.41) v1(74.8,85.39) v1(79.12,4.62) v1(79.12,3.61) v1(80.2,4.62) v1(80.2,3.61) v1(81.28,4.62) v1(81.28,3.61) v1(82.8,98.09) v1(82.8,97.08) v1(82.8,74.47) v1(82.8,73.39) v1(82.8,72.31) v1(83.57,16.94) v1(83.57,15.93) v1(83.82,74.47) v1(83.82,73.39) v1(83.82,72.31) v1(83.88,98.09) v1(83.88,97.08) v1(84.2,31.29) v1(84.2,30.28) v1(84.65,16.94) v1(84.65,15.93) v1(84.96,98.09) v1(84.96,97.08) v1(85.28,31.29) v1(85.28,30.28) v1(85.72,16.94) v1(85.72,15.93) v1(86.36,31.29) v1(86.36,30.28) v1(87.5,90.22) v1(87.5,89.2) v1(88.01,48.18) v1(88.01,47.17) v1(88.58,90.22) v1(88.58,89.2) v1(89.09,48.18) v1(89.09,47.17) v1(89.28,57.07) v1(89.28,56.06) v1(89.66,90.22) v1(89.66,89.2) v1(90.17,48.18) v1(90.17,47.17) v1(90.36,57.07) v1(90.36,56.06) v1(91.44,57.07) v1(91.44,56.06) v1(93.22,16.56) v1(93.22,15.54) v1(93.73,86.67) v1(93.73,85.65) v1(94.3,16.56) v1(94.3,15.54) v1(94.81,86.67) v1(94.81,85.65) v1(95.25,65.46) v1(95.25,64.44) v1(95.38,16.56) v1(95.38,15.54) v1(95.88,86.67) v1(95.88,85.65) v1(96.33,65.46) v1(96.33,64.44) v1(96.27,29.13) v1(96.27,28.12) v1(97.16,80.95) v1(97.16,79.87) v1(97.16,78.79) v1(97.28,46.66) v1(97.28,45.58) v1(97.28,44.5) v1(97.35,29.13) v1(97.35,28.12) v1(97.41,65.46) v1(97.41,64.44) v1(98.17,80.95) v1(98.17,79.87) v1(98.17,78.79) v1(98.3,46.66) v1(98.3,45.58) v1(98.3,44.5) v1(98.43,29.13) v1(98.43,28.12)
AIN1: length 77.8
  Top Layer w0.254: v1(38.74,19.61) 38.74,26.6 38.71,26.62 38.71,27.08 38.74,27.1 38.74,42.09 37.47,43.36 33,43.36
  Bottom Layer w0.254: v1(38.74,19.61) 81.41,19.61 82.3,20.5 82.3,23.67 CN9.8
AIN2: length 71.3
  Top Layer w0.254: 30.47,45.9 31.74,44.63 37.85,44.63 39.37,43.1 v1(39.37,26.59)
  Bottom Layer w0.254: CN9.6 82.13,26.34 39.62,26.34 v1(39.37,26.59)
BIN1: length 76.4
  Top Layer w0.254: 33,48.44 38.99,48.44 40.13,47.3 v1(40.13,20.62)
  Bottom Layer w0.254: CN9.7 80.92,21.53 80.01,20.62 v1(40.13,20.62)
BIN2: length 85.7
  Bottom Layer w0.254: CN9.5 83.42,20.65 83.95,20.12 92.33,20.12 93.22,21.01 93.22,58.72 92.07,59.87 68.45,59.87 67.82,60.5 67.82,65.33 67.06,66.09 63.59,66.09 63.48,66.2
CIN1: length 59.1
  Top Layer w0.254: v1(69.09,62.28) 69.09,44.25 69.85,43.48 80.01,43.48 80.92,42.58 CN10.8 ; v1(59.44,71.17) 53.44,71.17 53.32,71.28 ; v1(69.09,67.74) v1(69.09,69.39)
  Bottom Layer w0.254: v1(69.09,62.28) v1(69.09,67.74) ; v1(69.09,69.39) 69.09,70.54 68.45,71.17 v1(59.44,71.17)
CIN2: length 93.9
  Top Layer w0.254: 30.47,78.92 30.47,78.9 28.7,77.14 28.7,75.87 29.46,75.11 38.23,75.11 40.82,72.52 v1(40.82,39.55)
  Bottom Layer w0.254: CN10.6 83.42,39.29 83.16,39.55 v1(40.82,39.55)
DIN1: length 97.3
  Top Layer w0.254: 30.47,76.38 31.51,77.42 39.6,77.42 41.4,75.62 v1(41.4,31.93)
  Bottom Layer w0.254: v1(41.4,31.93) 41.59,31.74 77.15,31.74 80.92,35.5 CN10.7
DIN2: length 23.5
  Top Layer w0.254: v1(69.34,37.01) 82.42,37.01 83.42,36.01 CN10.5 ; v1(67.18,37.14) 62.07,37.14 60.94,38.26
  Bottom Layer w0.254: v1(69.34,37.01) 69.22,37.14 v1(67.18,37.14)
E1A: length 52.7
  Top Layer w0.254: v1(60.32,23.04) 63.06,20.31 78.93,20.31 79.76,21.13 79.76,23.71 CN9.10
  Bottom Layer w0.254: v1(60.32,23.04) 33,23.04
E1B: length 83.1
  Top Layer w0.254: v1(45.59,25.45) v1(45.59,62.41)
  Bottom Layer w0.254: v1(45.59,25.45) 45.99,25.05 CN9.12 ; 30.47,63.68 31.51,62.64 45.36,62.64 v1(45.59,62.41)
E2A: length 69.2
  Top Layer w0.254: v1(42.8,24.44) 42.8,45.9 v1(42.93,46.03)
  Bottom Layer w0.254: CN9.9 77,21.13 64.26,21.13 61.21,24.18 43.05,24.18 v1(42.8,24.44) ; v1(42.93,46.03) 33.13,46.03 33,45.9
E2B: length 71.8
  Top Layer w0.254: v1(44.07,24.82) v1(44.07,49.71)
  Bottom Layer w0.254: v1(44.07,24.82) 44.2,24.69 62.99,24.69 65.13,22.55 CN9.11 ; 30.47,48.44 31.74,49.71 v1(44.07,49.71)
E3A: length 30.9
  Top Layer w0.254: 63.48,56.04 63.59,55.93 67.69,55.93 68.33,55.3 68.33,43.74 69.22,42.85 77.09,42.85 78.1,41.83 78.1,38.7 CN10.10
E3B: length 27.1
  Top Layer w0.254: 60.94,28.1 62.83,26.21 67.56,26.21 68.33,26.97 68.33,37.64 69.07,38.39 CN10.12
E4A: length 51.3
  Bottom Layer w0.254: CN10.9 77.26,34.72 63.95,34.72 63.91,34.68 32.51,34.68 31.62,33.8 31.62,32.18 30.47,31.02 30.47,30.66
E4B: length 46.4
  Bottom Layer w0.254: CN10.11 66.27,35.89 65.15,37.01 31.74,37.01 30.47,35.74
GRAY_SCL: length 47.8
  Top Layer w0.254: CN3.3 CN2.3 CN1.3 8.28,52.9 8.89,53.52 24.89,53.52 25.65,54.28 25.65,56.44 26.67,57.45 32.51,57.45 33,57.95 33,58.6
GRAY_SDA: length 48.4
  Top Layer w0.254: 30.47,58.6 30.21,58.34 25.53,58.34 24.89,57.71 24.89,54.53 24.38,54.03 6.22,54.03 5.78,53.58 CN1.4 CN2.4 CN3.4
LED0: length 36.9
  Top Layer w0.254: 33,35.74 31.86,34.59 17.02,34.59 16.26,33.83 16.26,32.44 15.37,31.55 8.76,31.55 7.87,30.66 7.87,24.44 6.73,23.29 5.72,23.29
LED1: length 35.2
  Top Layer w0.254: 5.72,20.75 8,20.75 8.64,21.39 8.64,30.4 9.14,30.91 15.62,30.91 17.91,33.2 30.47,33.2
LED2: length 40.2
  Top Layer w0.254: 33,33.2 31.61,31.8 17.91,31.8 16.64,30.53 9.78,30.53 9.27,30.02 9.27,18.59 8.89,18.21 5.72,18.21
LED3: length 36.2
  Top Layer w0.254: 5.72,15.67 9.02,15.67 9.91,16.56 9.91,27.1 11.05,28.25 30.34,28.25 30.47,28.12
PA2: length 37.8
  Top Layer w0.254: 33,38.28 32.64,38.28 31.6,39.32 18.06,39.32 v1(18.03,39.29)
  Bottom Layer w0.254: CN7.4 20.19,60.25 18.03,58.09 v1(18.03,39.29)
PB4: length 60.3
  Bottom Layer w0.254: 33,61.14 31.96,62.18 24.92,62.18 23.65,60.91 23.65,51.97 24.89,50.73 24.89,26.97 18.89,20.97 18.89,15.96 U13.6
PB5: length 53.5
  Bottom Layer w0.254: 30.47,61.14 24.89,61.14 24,60.25 24,52.12 25.27,50.85 25.27,26.85 19.3,20.88 19.3,20.12 19.24,20.06 19.24,18.15 U13.5
PB8: length 45.1
  Top Layer w0.254: v1(25.02,52.88) 26.92,54.79 31.74,54.79 33,56.06
  Bottom Layer w0.254: v1(25.02,52.88) 25.7,52.2 25.7,25.53 20.32,20.15 U13.4
PB9: length 47.6
  Bottom Layer w0.254: U13.3 21.72,15.67 21.72,21.04 26.06,25.39 26.06,55.07 27.05,56.06 30.47,56.06
PB10: length 19.3
  Top Layer w0.254: 30.47,50.98 30.34,50.85 24.77,50.85 24.13,50.22 24.13,41.83 23.3,41 CN8.4
PB11: length 20.8
  Top Layer w0.254: 33,50.98 31.86,52.12 24.64,52.12 23.62,51.11 23.62,44.37 22.75,43.5 CN8.3
PB12: length 30.1
  Bottom Layer w0.254: 63.48,68.74 63.5,68.76 84.2,68.76 85.16,69.71 CN12.1
PB13: length 60.8
  Top Layer w0.254: 60.94,68.74 57.01,68.74 56.13,67.87 56.13,64.69 55.5,64.06 50.55,64.06 49.28,62.79 OLED1.3
PB14: length 28.3
  Top Layer w0.254: 63.48,63.66 63.59,63.55 75.82,63.55 76.71,62.66 76.71,49.93 U14.1
PB15: length 54
  Top Layer w0.254: 60.94,63.66 53.2,63.66 51.82,62.28 OLED1.4
PC0: length 60.2
  Top Layer w0.254: 30.47,40.82 31.51,39.78 34.95,39.78 36.83,37.9 36.83,8.05 35.94,7.16 25.55,7.16 25.53,7.14 16.28,7.14 SW0.B
PC1: length 45.1
  Top Layer w0.254: SW1.B 35.04,8.42 36.45,9.83 36.45,35.99 35.5,36.94 31.94,36.94 30.61,38.28 30.47,38.28
PC2: length 77.9
  Top Layer w0.254: SW2.B 74.75,8.17 38.88,8.17 37.86,9.18 37.86,41.06 36.7,42.22 31.61,42.22 30.47,43.36
PC3: length 85.8
  Top Layer w0.254: 33,40.82 36.58,40.82 37.34,40.06 37.34,7.67 38.35,6.66 83.24,6.66 SW3.B
PC6: length 51.3
  Bottom Layer w0.254: 50.78,66.2 52.2,67.61 57.28,67.61 58.29,68.63 58.29,80.31 59.56,81.58 84.07,81.58 85.16,82.67 CN5.1
PC7: length 56.8
  Bottom Layer w0.254: CN4.1 83.95,92.92 83.95,82.73 83.31,82.09 59.06,82.09 57.78,80.82 57.78,70.66 57.15,70.03 52.07,70.03 50.78,68.74
PC8: length 44.1
  Top Layer w0.254: 50.78,71.28 52.07,72.57 78.36,72.57 79.38,71.55 79.38,58.84 U12.1
PC9: length 28.6
  Top Layer w0.254: 53.32,68.74 54.99,70.41 76.84,70.41 78.09,69.16 U11.1
PC10: length 32.2
  Top Layer w0.254: CN11.4 67.12,93.84 66.29,93.02 54.1,93.02 53.34,92.25 53.34,76.38 53.32,76.36
PC11: length 31.4
  Top Layer w0.254: 50.78,76.36 50.8,76.38 50.8,92.76 51.69,93.65 62.59,93.65 CN11.3
PC12: length 45.3
  Top Layer w0.254: v1(59.94,79.17) 58.17,79.17 57.53,78.54 57.53,74.73 56.62,73.82 53.32,73.82
  Bottom Layer w0.254: CN6.3 92.73,77.76 91.31,79.17 v1(59.94,79.17)
PD0: length 63.5
  Top Layer w0.254: v1(53.59,16.56) v1(53.59,35.61) ; v1(35.18,18.21) 19.18,18.21 U13.7
  Bottom Layer w0.254: 60.94,35.72 60.83,35.61 v1(53.59,35.61) ; v1(35.18,18.21) 40.26,18.21 41.91,16.56 v1(53.59,16.56)
PD1: length 69.5
  Top Layer w0.254: v1(55.88,38.02) 55.63,37.77 v1(55.63,15.67) ; U13.8 19.05,15.8 v1(34.67,15.8) ; v1(58.93,38.02) 60.32,39.42 62.32,39.42 63.48,38.26
  Bottom Layer w0.254: v1(55.63,15.67) 34.8,15.67 v1(34.67,15.8) ; v1(55.88,38.02) v1(58.93,38.02)
PD2: length 47.7
  Top Layer w0.254: 50.78,73.82 52.07,75.11 56.39,75.11 57.02,75.74 57.02,79.55 57.78,80.31 v1(60.07,80.31)
  Bottom Layer w0.254: CN6.2 60.13,80.26 v1(60.07,80.31)
PD3: length 63.2
  Bottom Layer w0.254: U13.9 16.7,15.61 16.7,20.06 17.33,20.69 17.74,20.69 24.54,27.48 24.54,50.32 22.99,51.87 22.99,65.08 24.26,66.34 30.34,66.34 30.47,66.22
PD4: length 55.7
  Top Layer w0.254: v1(34.8,21.51) 17.14,21.51 U13.10 ; v1(47.75,21.64) v1(47.75,30.78)
  Bottom Layer w0.254: v1(47.75,21.64) 47.62,21.51 v1(34.8,21.51) ; v1(47.75,30.78) 60.8,30.78 60.94,30.64
PD5: length 67.7
  Top Layer w0.254: v1(34.8,13.13) 34.67,13 17.53,13 16.38,14.15 16.38,15.93 U13.11 ; v1(54.61,13.13) v1(54.61,29.26)
  Bottom Layer w0.254: v1(54.61,29.26) 62.1,29.26 63.48,30.64 ; v1(54.61,13.13) v1(34.8,13.13)
PD6: length 14
  Top Layer w0.254: CN7.3 21.82,64.95 31.74,64.95 33,63.68
PD7: length 67.3
  Top Layer w0.254: v1(34.67,11.35) 18.42,11.35 U13.12 ; v1(56.39,11.48) v1(56.39,28.12)
  Bottom Layer w0.254: v1(34.67,11.35) 34.8,11.48 v1(56.39,11.48) ; v1(56.39,28.12) 59.18,28.12 60.45,26.85 61.16,26.85 62.43,28.12 63.47,28.12 63.48,28.1
PE0: length 42.7
  Bottom Layer w0.254: 33,53.52 31.74,52.25 28.19,52.25 27.05,51.11 27.05,21.26 U13.2
PE1: length 38.7
  Bottom Layer w0.254: 30.47,53.52 30.34,53.64 27.94,53.64 26.42,52.12 26.42,23.16 U13.1
PE8: length 46
  Top Layer w0.254: v1(75.18,40.82) 75.17,40.8 63.48,40.8 ; v1(91.19,40.94) 91.19,25.71 90.53,25.05 CN9.2
  Bottom Layer w0.254: v1(91.19,40.94) 75.31,40.94 v1(75.18,40.82)
PE9: length 55.6
  Top Layer w0.254: CN9.4 84.71,23.84 84.71,20.24 83.95,19.48 59.06,19.48 58.04,20.5 58.04,40.18 58.67,40.82 60.93,40.82 60.94,40.8
PE11: length 58.4
  Top Layer w0.254: 60.94,43.34 57.9,43.34 57.4,42.85 57.4,20.12 58.42,19.1 85.22,19.1 85.92,19.8 CN9.3
PE13: length 33.1
  Top Layer w0.254: CN10.4 85.92,43.29 84.96,44.25 71.25,44.25 70.17,45.33 v1(70.17,47.17)
  Bottom Layer w0.254: v1(70.17,47.17) 62.23,47.17 60.94,45.88
PE14: length 35.5
  Top Layer w0.254: v1(71.12,48.44) 71.12,46.03 72.39,44.75 86.23,44.75 87.25,43.74 87.25,37.22 CN10.3
  Bottom Layer w0.254: 63.48,48.42 63.5,48.44 v1(71.12,48.44)

## Copper pours and planes (outline as drawn; the poured copper is in the pictures)
5V on Top Layer: 32.26,78.03 34.93,78.03 36.19,79.3 36.19,82.35 34.54,84 27.18,84 23.5,80.31 6.73,80.31 4.7,78.28 4.7,75.33 5.69,74.35 7.75,74.35 8.64,73.46 8.64,71.93 5.84,69.14 5.84,66.33 6.34,65.84 7.87,65.84 9.27,64.44 11.51,64.44 12.32,65.25 12.32,71.04 13.33,72.06 17.53,72.06 18.29,71.3 18.29,67.87 19.18,66.98 21.34,66.98 22.22,67.87 22.22,72.95 29.72,80.44 31.12,80.44 31.62,79.93 31.62,78.66
GND on Top Layer: -6.22,107.49 105.54,107.49 105.54,-13.66 -6.22,-13.66
GND on Bottom Layer: -4.57,107.75 114.43,107.75 114.43,-18.87 -4.57,-18.87
$1N183 on Top Layer: 2.61,86.92 22.88,86.92 22.88,80.94 2.61,80.94

Small or netless copper shapes (teardrops, artwork), in the pictures only: 150 on Top Layer, 99 on Bottom Layer

## Text on the board
Top Silkscreen Layer: 自动分拣机器人主控板 | G | 3V3 | SCL | SDA | LED0 | LED1 | LED2 | LED3 | RX | TX | D4 | D5 | D7 | D0 | D1 | D3 | B8 | B5 | B4 | E1 | E0 | B9 | 5V | 备用串口接口 | E3B | E4B | E1B | E2B | C8 | C9 | B14 | B12 | C7 | C6 | 激光接口1 | 激光接口2 | 激光接口3 | 测距 / 接口 / 1 | 测距 / 接口 / 2 | 测距 / 接口 / 3 | 舵机控制器接口 | TB6612接口1 | TB6612接口2 | 灰度 / 接口 / 一 | 灰度 / 接口 / 二 | 灰度 / 接口 / 三 | LED模块接口 | 拓展引脚 | 3 / V / 3 | 5 / V | 0 | 1 | 2 | 3 | 5V输出接口 | 5V输入接口 | 电源拓展 | 视觉接口 | 陀螺仪接口 | + | - | 总开关
